# EAGLE design zasilanie (EAGLE 8.6.3)
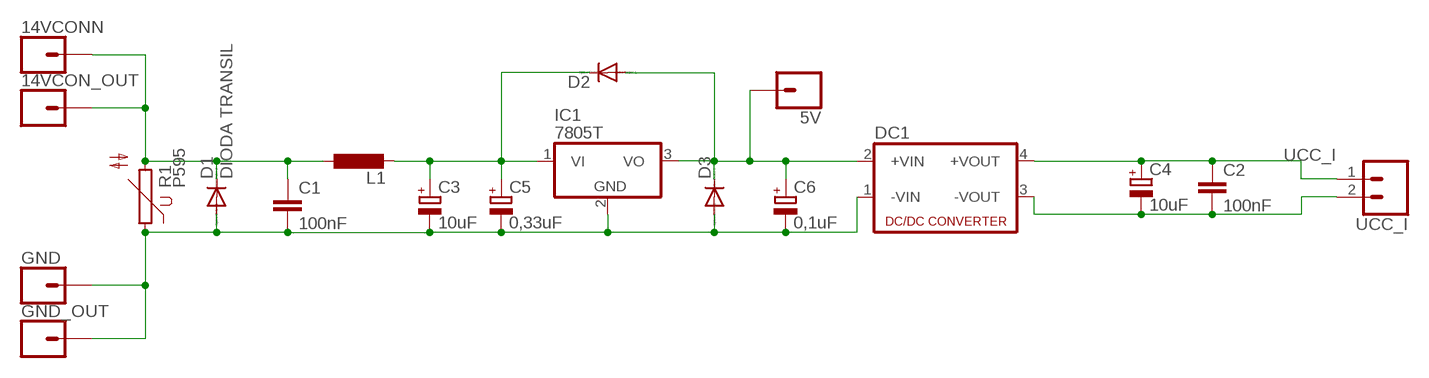
[diagram p0: schematic, sheet 1]

## Parts
5V  CONN_01PTH_LONGPAD  [1X01_LONGPAD]
14VCON_OUT  CONN_01PTH_LONGPAD  [1X01_LONGPAD]
14VCONN  CONN_01PTH_LONGPAD  [1X01_LONGPAD]
C1  100nF  C-EU025-024X044  [C025-024X044]
C2  100nF  C-EU025-024X044  [C025-024X044]
C3  10uF  CPOL-EUE2.5-7  [E2,5-7]
C4  10uF  CPOL-EUE2.5-7  [E2,5-7]
C5  0,33uF  CPOL-EUE2.5-7  [E2,5-7]
C6  0,1uF  CPOL-EUE2.5-7  [E2,5-7]
D1  DIODA TRANSIL  1N4004  [DO41-10]
D2  1N4004  [DO41-10]
D3  1N4004  [DO41-10]
DC1  NME  [NME]
GND  CONN_01PTH_LONGPAD  [1X01_LONGPAD]
GND_OUT  CONN_01PTH_LONGPAD  [1X01_LONGPAD]
IC1  7805T  [TO220H]
L1  L-EUTJ6-U1  [TJ6-U1]
R1  P595  [P595]
UCC_I  CONN_02LOCK  [1X02_LOCK]

## Nets
GND: C1.2 C3.- C5.- C6.- D1.A D3.A DC1.1(-VIN) GND.1 GND_OUT.1 IC1.2(GND) R1.1
GND_I: C2.2 C4.- DC1.3(-VOUT) UCC_I.2
N$2: C3.+ C5.+ D2.C IC1.1(VI) L1.2
N$3: 5V.1 C6.+ D2.A D3.C DC1.2(+VIN) IC1.3(VO)
N$4: 14VCON_OUT.1 14VCONN.1 C1.1 D1.C L1.1 R1.2
UCC_I: C2.1 C4.+ DC1.4(+VOUT) UCC_I.1

## Library data of the parts
5V 14VCON_OUT 14VCONN GND GND_OUT = SparkFun-Connectors:CONN_01: Single connection point. Often used as Generic Header-pin footprint for 0.1 inch spaced/style header connections On any of the 0.1 inch spaced packages, you can populate with these: Break Away Headers - Straight <https://www.sparkfun.com/products/116> (PRT-00116) Break Away Male Headers - Right Angle <https://www.sparkfun.com/products/553> (PRT-00553) Female Headers <https://www.sparkfun.com/products/115> (PRT-00115) Break Away Headers - Machine Pin <https://www.sparkfun.com/products/117> (PRT-00117) Break Away Female Headers - Swiss Machine Pin <https://www.sparkfun.com/products/743> (PRT-00743) This device is also useful as a general connection point to wire up your design to another part of your project. Our various solder wires solder well into these plated through hole pads. Hook-Up Wire - Assortment (Stranded, 22 AWG) <https://www.sparkfun.com/products/11375> (PRT-11375) Hook-Up Wire - Assortment (Solid Core, 22 AWG) <https://www.sparkfun.com/products/11367> (PRT-11367) View the entire wire category on our website here <https://www.sparkfun.com/categories/141> Special notes: SMTSO-256-ET is a "flush mount" nut for a 4-40 screw. We mostly use this on specialty testbeds; it is a nice way to connect hardware to your PCB at an adjustable hieght. Also note, the SNAP packages are for using a snappable style connector. We sell a baggie of snaps and they are also used on two LilyPad designs: Snap Assortment - 30 pack (male and female) <https://www.sparkfun.com/products/11347> (DEV-11347) LilyPad Arduino SimpleSnap <https://www.sparkfun.com/products/10941> (DEV-10941) LilyPad SimpleSnap Protoboard <https://www.sparkfun.com/products/10940> (DEV-10940)
C1 C2 = rcl:C-EU: CAPACITOR, European symbol; SPICEPREFIX: C
C3-C6 = rcl:CPOL-EU: POLARIZED CAPACITOR, European symbol; SPICEPREFIX: C
D1-D3 = diode:1N4004: DIODE general purpose rectifier, 1 A
DC1 = dc-dc-converter:NME: DC-DC CONVERTER; MF: C & D TECHNOLOGIES, INC; MPN: NME1205D; OC_FARNELL: 1021466; OC_NEWARK: 98B8198
IC1 = linear:78*: Positive VOLTAGE REGULATOR Source: http://cache.national.com/ds/LM/LM78L05.pdf http://www.fairchildsemi.com/ds/LM/LM7805.pdf
L1 = rcl:L-EU: INDUCTOR, European symbol; SPICEPREFIX: L
R1 = varistor:P595: VARISTOR
UCC_I = SparkFun-Connectors:CONN_02: Multi connection point. Often used as Generic Header-pin footprint for 0.1 inch spaced/style header connections On any of the 0.1 inch spaced packages, you can populate with these: Break Away Headers - Straight <https://www.sparkfun.com/products/116> (PRT-00116) Break Away Male Headers - Right Angle <https://www.sparkfun.com/products/553> (PRT-00553) Female Headers <https://www.sparkfun.com/products/115> (PRT-00115) Break Away Headers - Machine Pin <https://www.sparkfun.com/products/117> (PRT-00117) Break Away Female Headers - Swiss Machine Pin <https://www.sparkfun.com/products/743> (PRT-00743) For SCREWTERMINALS and SPRING TERMINALS visit here: Screw Terimnals on SparkFun.com <https://www.sparkfun.com/search/results?term=Screw+Terminals> (5mm/3.5mm/2.54mm spacing) This device is also useful as a general connection point to wire up your design to another part of your project. Our various solder wires solder well into these plated through hole pads. Hook-Up Wire - Assortment (Stranded, 22 AWG) <https://www.sparkfun.com/products/11375> (PRT-11375) Hook-Up Wire - Assortment (Solid Core, 22 AWG) <https://www.sparkfun.com/products/11367> (PRT-11367) View the entire wire category on our website here <https://www.sparkfun.com/categories/141> Special notes: Molex polarized connector foot print use with: PRT-08233 with associated crimp pins and housings. 2.54_SCREWTERM for use with PRT-10571. 3.5mm Screw Terminal footprints for PRT-08084 5mm Screw Terminal footprints for use with PRT-08432

## Board
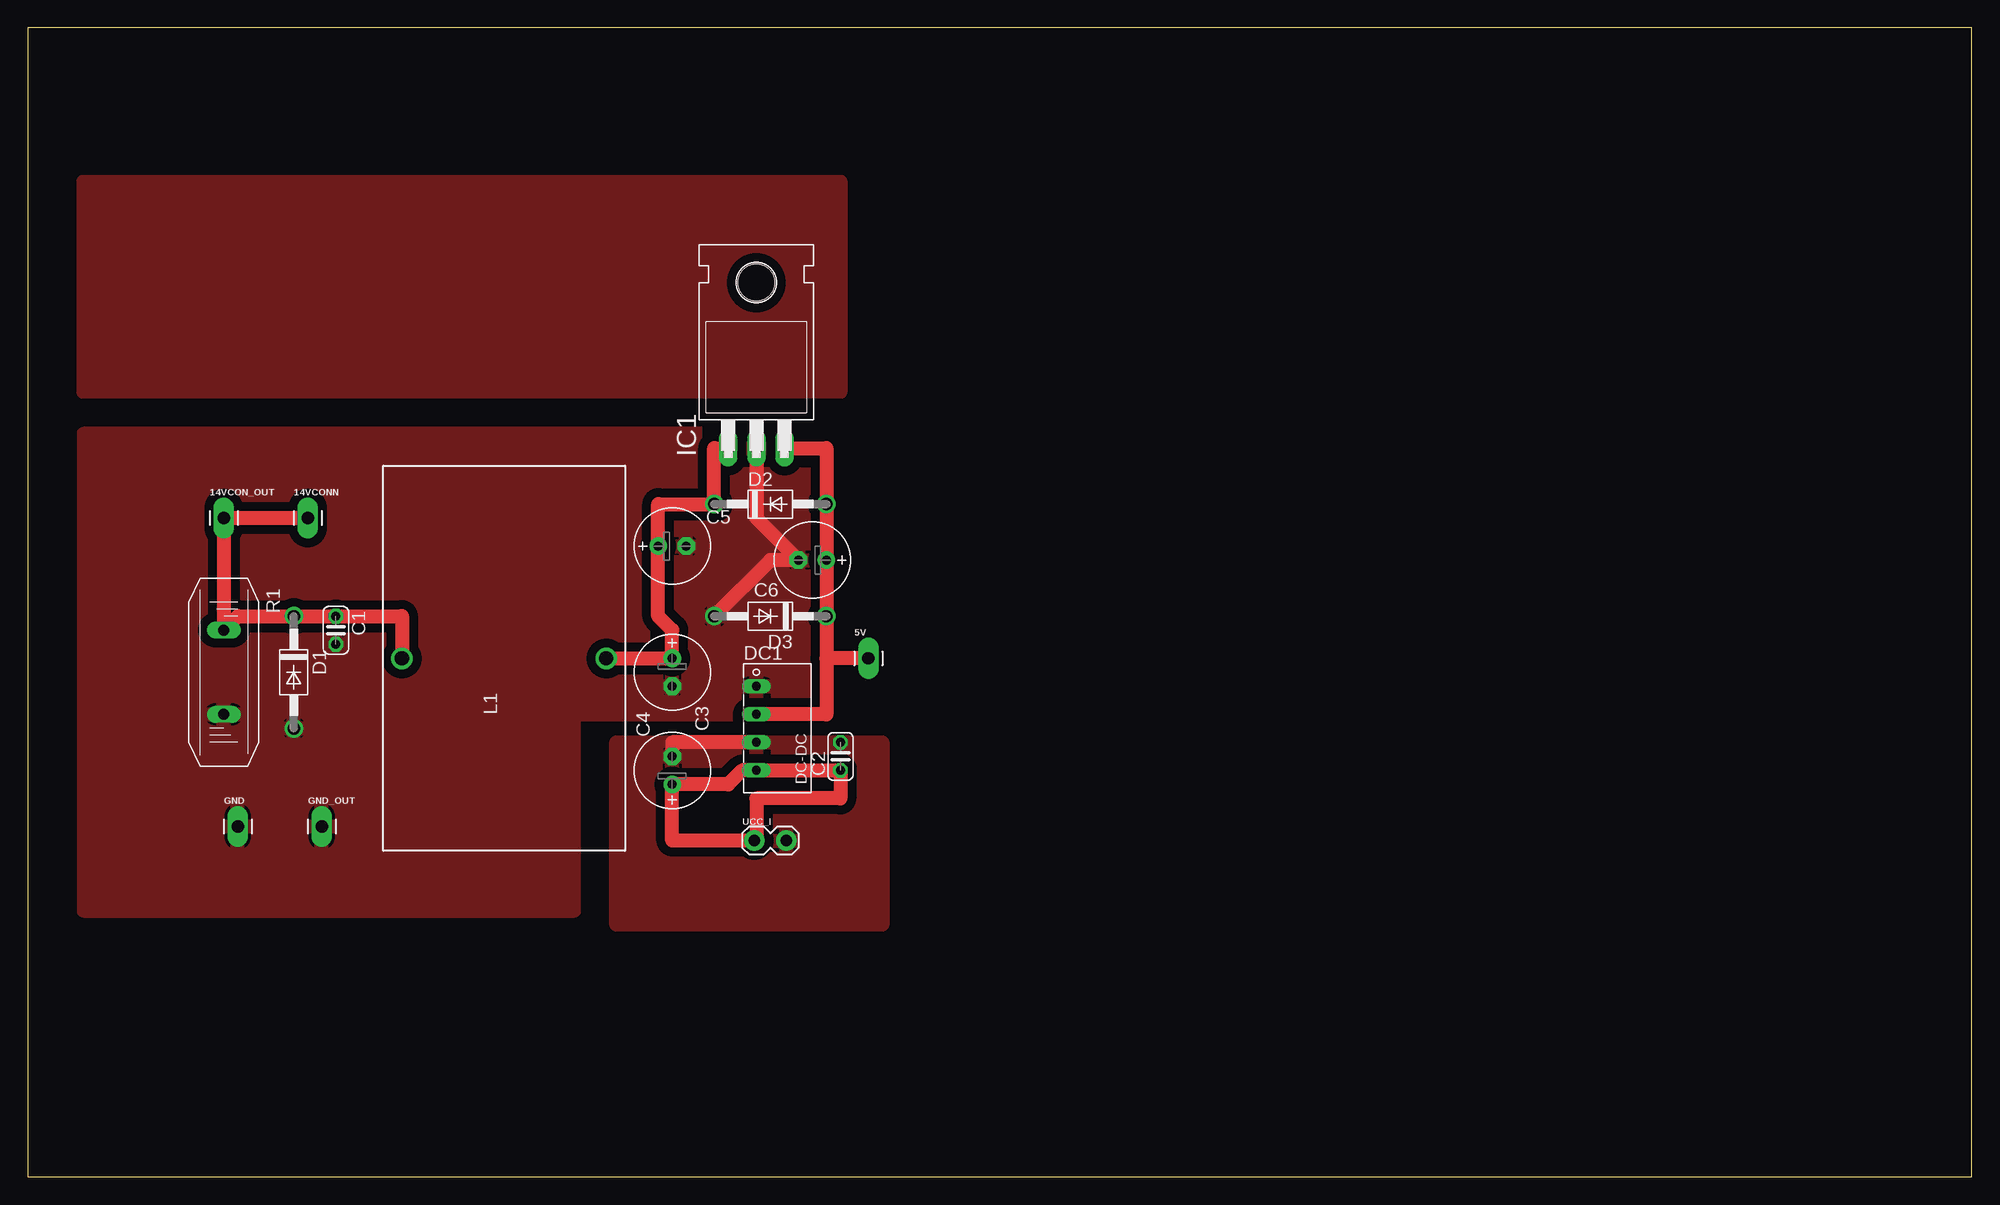
[diagram p1: board, top side]

Size 176.2 x 104.13 mm. Coordinates in mm from the lower left corner, seen from the top.
Outline: 0,0 176.2,0 176.2,104.13 0,104.13 0,0
Copper layers (1*16): Top 0.035mm / dielectric 1.5mm / Bottom 0.035mm
Design rules "default": minimum track width 6mil, minimum drill 0.35mm, track to track 6mil, track to pad 6mil, pad to pad 6mil, via to via 6mil, smd to smd 6mil, copper to edge 40mil, drill to drill 6mil, minimum pad ring 10mil, minimum via ring 8mil, stop-mask expansion 4mil, vias tented up to drill 0mil, thermal gap 10mil

### Footprints (pad centres in the part's own frame; a part is rotated, then mirrored left to right if it is on the bottom)
1X01_LONGPAD = drill 1.118 pad 1.88 long: 1 0,0
C025-024X044 = drill 0.813 octagon: 1 -1.27,0; 2 1.27,0
E2,5-7 = drill 0.813 pad 1.6: + -1.27,0 | drill 0.813 pad 1.6 octagon: - 1.27,0
DO41-10 = drill 1.118: A 5.08,0; C -5.08,0
NME = drill 0.813 long: 1 0,3.81; 2 0,1.27; 3 0,-1.27; 4 0,-3.81
TO220H = drill 1.118 long: 1 -2.54,-10.16; 2 0,-10.16; 3 2.54,-10.16 | hole 3.302: 0,4.826
TJ6-U1 = drill 1.3: 1 -9.25,0; 2 9.25,0
P595 = drill 1.016 long: 1 0,3.81; 2 0,-3.81
1X02_LOCK = drill 1.016 pad 1.88: 1 -0.178,0; 2 2.718,0

### Placement (x,y rotation side)
5V  76.2,46.99 0 top
14VCON_OUT  17.78,59.69 0 top
14VCONN  25.4,59.69 0 top
C1  27.94,49.53 270 top
C2  73.66,38.1 90 top
C3  58.42,45.72 270 top
C4  58.42,36.83 90 top
C5  58.42,57.15 0 top
C6  71.12,55.88 180 top
D1  24.13,45.72 270 top
D2  67.31,60.96 0 top
D3  67.31,50.8 180 top
DC1  66.04,40.64 0 top
GND  19.05,31.75 0 top
GND_OUT  26.67,31.75 0 top
IC1  66.04,76.2 0 top
L1  43.18,46.99 0 top
R1  17.78,45.72 180 top
UCC_I  66.04,30.48 0 top

### Tracks (layer width: path | path; a pad name or v marks a point on that pad's centre or on a via)
GND
  Top 1.27: IC1.2 66.04,59.69 C6.- 67.31,55.88 D3.A
  pour Top (isolate 0.813): 81.28,41.91 81.28,67.31 5.08,67.31 5.08,24.13 49.53,24.13 49.53,41.91
GND_I
  Top 1.27: DC1.3 58.42,39.37 C4.-
  pour Top (isolate 0.813): 53.34,39.37 77.47,39.37 77.47,22.86 53.34,22.86
N$1
  pour Top (isolate 0.813): 73.66,71.12 5.08,71.12 5.08,90.17 73.66,90.17 73.66,72.39
N$2
  Top 1.27: L1.2 C3.+ 58.42,49.53 57.15,50.8 C5.+ 57.15,60.96 D2.C 62.23,66.04 IC1.1
N$3
  Top 1.27: IC1.3 72.39,66.04 D2.A C6.+ D3.C 72.39,46.99 | 72.39,46.99 72.39,41.91 DC1.2 | 5V.1 72.39,46.99
N$4
  Top 1.27: 14VCONN.1 14VCON_OUT.1 R1.2 19.05,50.8 D1.C C1.1 33.93,50.8 L1.1
UCC_I
  Top 1.27: DC1.4 64.77,36.83 63.5,35.56 C4.+ 58.42,30.48 UCC_I.1 66.04,30.66 66.04,34.29 73.66,34.29 C2.1 DC1.4